# Altium schematic sheet Half_Bridge.SchDoc
size A4; SheetNumber: 6; SheetTotal: 9
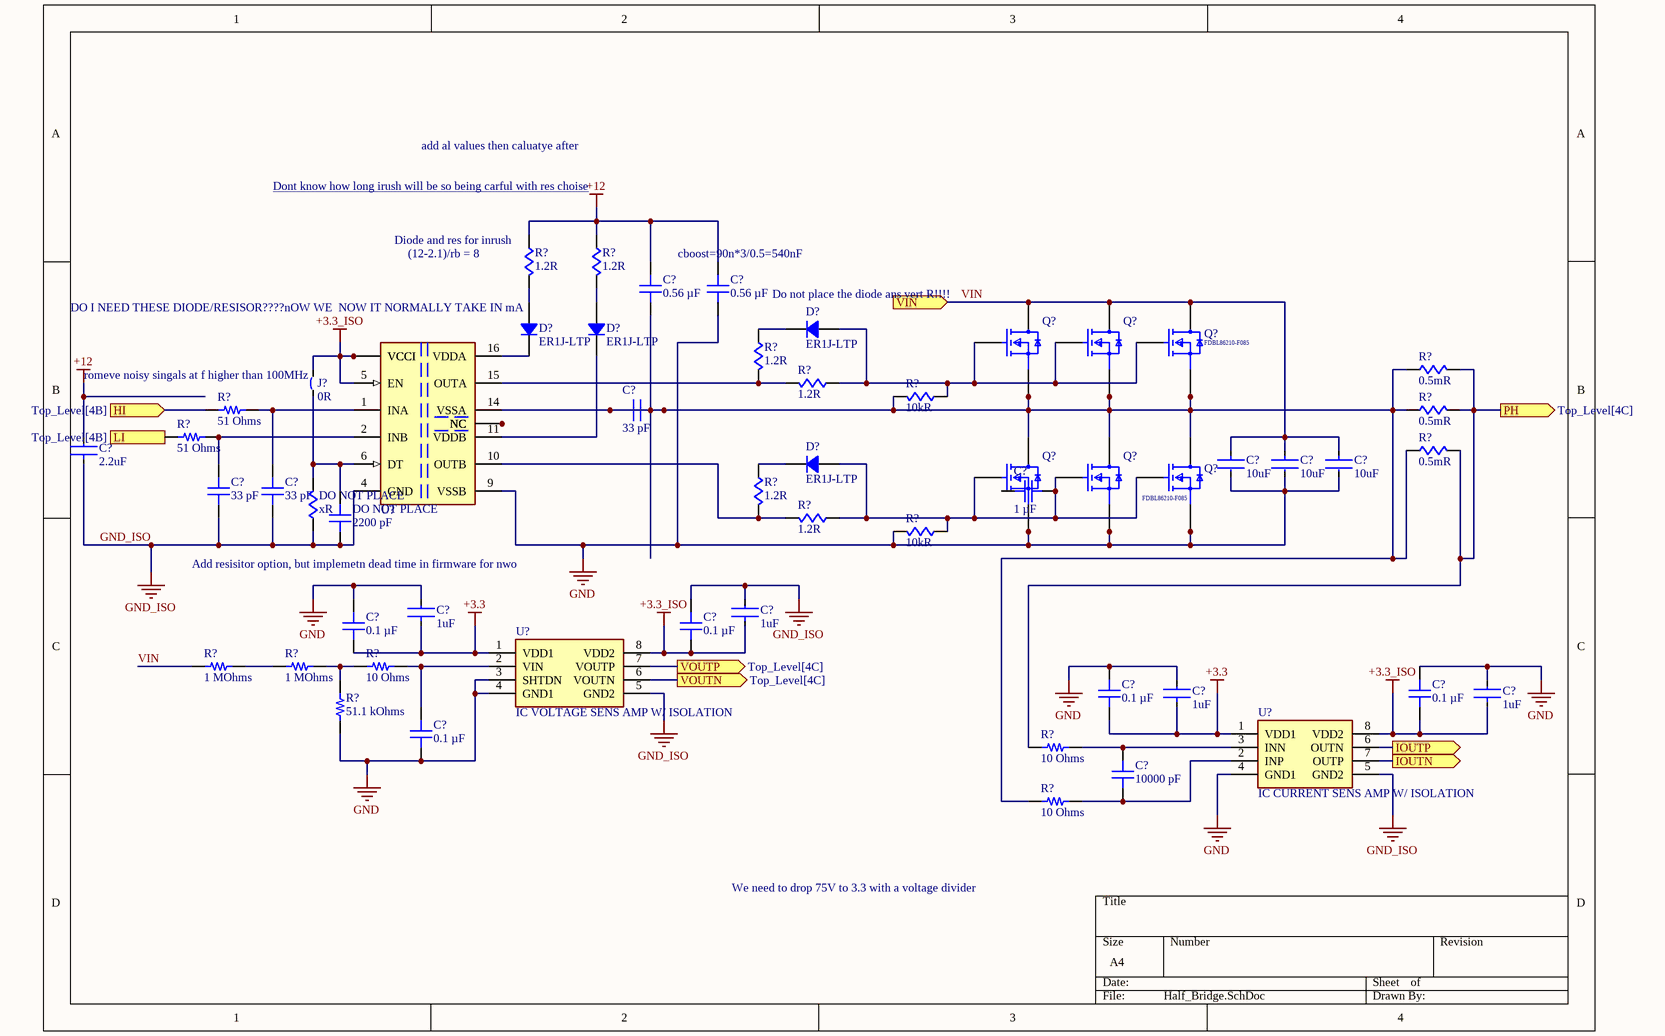
[diagram p0: Half_Bridge.SchDoc]

## Parts
(Parts that share a designator on the sheet are numbered #1, #2 ... from top to bottom, then left to right.)
C?#1  0.56 µF  [CAP 0805_2012]
C?#2  0.56 µF  [CAP 0805_2012]
C?#3  33 pF  [CAP 0402_1005]
C?#4  value 2.2uF  [FP-GCJ32D-0_4-IPC_C]  (hidden comment: SCER 2.2UF 100V X7R 1210)
C?#5  value 10uF  [FP-CL31-IPC_C]  (hidden comment: SCER 10UF 25V X7R 1206)
C?#6  value 10uF  [FP-CL31-IPC_C]  (hidden comment: SCER 10UF 25V X7R 1206)
C?#7  value 10uF  [FP-CL31-IPC_C]  (hidden comment: SCER 10UF 25V X7R 1206)
C?#8  33 pF  [CAP 0402_1005]
C?#9  33 pF  [CAP 0402_1005]
C?#10  1 µF  [CAP 0402_1005]
C?#11  value 1uF  [FP-CGA3E-0_3-0_1-IPC_C]  (hidden comment: CER 1UF 16V X7R 0603)
C?#12  value 1uF  [FP-CGA3E-0_3-0_1-IPC_C]  (hidden comment: CER 1UF 16V X7R 0603)
C?#13  0.1 µF  [CAP 0402_1005]
C?#14  0.1 µF  [CAP 0402_1005]
C?#15  0.1 µF  [CAP 0402_1005]
C?#16  value 1uF  [FP-CGA3E-0_3-0_1-IPC_C]  (hidden comment: CER 1UF 16V X7R 0603)
C?#17  0.1 µF  [CAP 0402_1005]
C?#18  value 1uF  [FP-CGA3E-0_3-0_1-IPC_C]  (hidden comment: CER 1UF 16V X7R 0603)
C?#19  0.1 µF  [CAP 0402_1005]
C?#20  10000 pF  [CAP 0603_1608]
D?#1  ER1J-LTP  [DO214AA SMB]
D?#2  ER1J-LTP  [DO214AA SMB]
D?#3  ER1J-LTP  [DO214AA SMB]
D?#4  ER1J-LTP  [DO214AA SMB]
DO_NOT_PLACE#1  value xR  [FP-RMCF0603-IPC_C]  (hidden comment: x)
DO_NOT_PLACE#2  2200 pF  [CAP 0402_1005]
J?  value 0R  [FP-RK73Z1J-IPC_C]  (hidden comment: RES 0 OHM JUMPER 0603)
Q?#1  N-CH 150V 169A 8HPSOF  [FP-100CU-MFG]  (value not drawn)
Q?#2  N-CH 150V 169A 8HPSOF  [FP-100CU-MFG]  (value not drawn)
Q?#3  N-CH 150V 169A 8HPSOF  [FP-100CU-MFG]  (value not drawn)
Q?#4  N-CH 150V 169A 8HPSOF  [FP-100CU-MFG]  (value not drawn)
Q?#5  N-CH 150V 169A 8HPSOF  [FP-100CU-MFG]  (value not drawn)
Q?#6  N-CH 150V 169A 8HPSOF  [FP-100CU-MFG]  (value not drawn)
R?#1  value 1.2R  [MMB0207_VIS-M]  (hidden comment: RES SMD 1.2 OHM 1% 1W 0207)
R?#2  value 1.2R  [MMB0207_VIS-M]  (hidden comment: RES SMD 1.2 OHM 1% 1W 0207)
R?#3  value 1.2R  [MMB0207_VIS-M]  (hidden comment: RES SMD 1.2 OHM 1% 1W 0207)
R?#4  value 0.5mR  [FP-PSL2NTEBL500F-MFG]  (hidden comment: RES 500 UOHM 1% 8W NONSTANDARD)
R?#5  value 1.2R  [MMB0207_VIS-M]  (hidden comment: RES SMD 1.2 OHM 1% 1W 0207)
R?#6  value 10kR  [FP-RMCF0603-IPC_C]  (hidden comment: RES 10K OHM 1% 1/10W 0603)
R?#7  51 Ohms  [RES 0402_1005]
R?#8  value 0.5mR  [FP-PSL2NTEBL500F-MFG]  (hidden comment: RES 500 UOHM 1% 8W NONSTANDARD)
R?#9  51 Ohms  [RES 0402_1005]
R?#10  value 0.5mR  [FP-PSL2NTEBL500F-MFG]  (hidden comment: RES 500 UOHM 1% 8W NONSTANDARD)
R?#11  value 1.2R  [MMB0207_VIS-M]  (hidden comment: RES SMD 1.2 OHM 1% 1W 0207)
R?#12  value 1.2R  [MMB0207_VIS-M]  (hidden comment: RES SMD 1.2 OHM 1% 1W 0207)
R?#13  value 10kR  [FP-RMCF0603-IPC_C]  (hidden comment: RES 10K OHM 1% 1/10W 0603)
R?#14  1 MOhms  [RES 0402_1005]
R?#15  1 MOhms  [RES 0402_1005]
R?#16  10 Ohms  [RES 0402_1005]
R?#17  51.1 kOhms  [RES 0402_1005]
R?#18  10 Ohms  [RES 0402_1005]
R?#19  10 Ohms  [RES 0402_1005]
U?#1  DGTL ISO 5.7KV GATE DRVR 16SOIC  [FP-DW0016B-IPC_B]  (value not drawn)
U?#2  IC VOLTAGE SENS AMP W/ ISOLATION  [SOIC127P1150X280-8N]
U?#3  IC CURRENT SENS AMP W/ ISOLATION  [FP-DWV0008A-IPC_B]

## Ports
HI (in, see Top_Level[4B]), IOUTN (out), IOUTP (out), LI (in, see Top_Level[4B]), PH (out, see Top_Level[4C]), VIN (in, see Top_Level[4B], Power[2A]), VOUTN (out, see Top_Level[4C]), VOUTP (out, see Top_Level[4C])

## Nets
+3.3: C?#11.1 C?#13.1 C?#15.1 C?#16.1 U?#2.1(VDD1) U?#3.1(VDD1)
+3.3_ISO: C?#12.1 C?#14.1 C?#17.1 C?#18.1 J?.2 U?#1.3(VCCI) U?#1.5(EN) U?#1.8(VCCI) U?#2.8(VDD2) U?#3.8(VDD2)
+12: C?#1.2 C?#2.2 C?#4.2 R?#1.1 R?#2.1
GND: C?#2.1 C?#5.2 C?#6.2 C?#7.2 C?#11.2 C?#13.2 C?#15.2 C?#16.2 C?#17.2 C?#18.2 C?#19.1 Q?#4.2(S) Q?#4.3(S) Q?#4.4(S) Q?#4.5(S) Q?#4.6(S) Q?#4.7(S) Q?#4.8(S) Q?#5.2(S) Q?#5.3(S) Q?#5.4(S) Q?#5.5(S) Q?#5.6(S) Q?#5.7(S) Q?#5.8(S) Q?#6.2(S) Q?#6.3(S) Q?#6.4(S) Q?#6.5(S) Q?#6.6(S) Q?#6.7(S) Q?#6.8(S) R?#13.2 R?#17.1 U?#1.9(VSSB) U?#2.3(SHTDN) U?#2.4(GND1) U?#3.4(GND1)
GND_ISO: C?#4.1 C?#8.1 C?#9.1 C?#12.2 C?#14.2 DO_NOT_PLACE#1.1 DO_NOT_PLACE#2.1 U?#1.4(GND) U?#2.5(GND2) U?#3.5(GND2)
HI: R?#7.1 ; port HI
IOUTN: U?#3.7(OUTP) ; port IOUTN
IOUTP: U?#3.6(OUTN) ; port IOUTP
LI: R?#9.1 ; port LI
PH: R?#4.2 R?#8.2 R?#10.2 R?#18.1 ; port PH
VIN: C?#5.1 C?#6.1 C?#7.1 Q?#1.9(D) Q?#2.9(D) Q?#3.9(D) R?#14.1 ; port VIN
VOUTN: U?#2.6(VOUTN) ; port VOUTN
VOUTP: U?#2.7(VOUTP) ; port VOUTP
NetC?#1_1: C?#1.1 C?#3.1 C?#3.2 Q?#1.2(S) Q?#1.3(S) Q?#1.4(S) Q?#1.5(S) Q?#1.6(S) Q?#1.7(S) Q?#1.8(S) Q?#2.2(S) Q?#2.3(S) Q?#2.4(S) Q?#2.5(S) Q?#2.6(S) Q?#2.7(S) Q?#2.8(S) Q?#3.2(S) Q?#3.3(S) Q?#3.4(S) Q?#3.5(S) Q?#3.6(S) Q?#3.7(S) Q?#3.8(S) Q?#4.9(D) Q?#5.9(D) Q?#6.9(D) R?#4.1 R?#6.2 R?#8.1 R?#10.1 R?#19.1 U?#1.14(VSSA)
NetC?#8_2: C?#8.2 R?#9.2 U?#1.2(INB)
NetC?#9_2: C?#9.2 R?#7.2 U?#1.1(INA)
NetC?#10_2: C?#10.2 D?#4.1 Q?#4.1(G) Q?#5.1(G) Q?#6.1(G) R?#12.1 R?#13.1
NetC?#19_2: C?#19.2 R?#16.2 U?#2.2(VIN)
NetC?#20_1: C?#20.1 R?#19.2 U?#3.2(INP)
NetC?#20_2: C?#20.2 R?#18.2 U?#3.3(INN)
NetD?#1_1: D?#1.1 R?#1.2
NetD?#1_2: D?#1.2 U?#1.16(VDDA)
NetD?#2_1: D?#2.1 R?#2.2
NetD?#2_2: D?#2.2 U?#1.11(VDDB)
NetD?#3_1: D?#3.1 Q?#1.1(G) Q?#2.1(G) Q?#3.1(G) R?#5.1 R?#6.1
NetD?#3_2: D?#3.2 R?#3.1
NetD?#4_2: D?#4.2 R?#11.1
NetDO_NOT_PLACE#1_2: DO_NOT_PLACE#1.2 DO_NOT_PLACE#2.2 J?.1 U?#1.6(DT)
NetR?#3_2: R?#3.2 R?#5.2 U?#1.15(OUTA)
NetR?#11_2: R?#11.2 R?#12.2 U?#1.10(OUTB)
NetR?#14_2: R?#14.2 R?#15.1
NetR?#15_2: R?#15.2 R?#16.1 R?#17.2
NetU?#1_7: U?#1.7(NC) U?#1.12(NC) U?#1.13(NC)

Not connected (* = marked no-connect by the designer): C?#10 1

## Notes on the sheet
- add al values then caluatye after
- Dont know how long irush will be so being carful with res choise <https://www.vishay.com/docs/48516/_ms9702509-2003-vishaychecklistpulseload.pdf>
- (near R?#1) Diode and res for inrush
- DO I NEED THESE DIODE/RESISOR????nOW WE  NOW IT NORMALLY TAKE IN mA
- (near R?#1) (12-2.1)/rb = 8
- (near C?#2) cboost=90n*3/0.5=540nF
- Do not place the diode ans vert R!!!!
- (near J?) romeve noisy singals at f higher than 100MHz
- Add resisitor option, but implemetn dead time in firmware for nwo
- We need to drop 75V to 3.3 with a voltage divider

## Library data of the parts
C?#1 C?#2 = C0805C564K5RAC7800: CAP CER 0.56UF 50V X7R 0805; manufacturer: KEMET; Tolerance: ±10%; Part Number: C0805C564K5RAC7800; Value: 0.56 µF; Applications: Bypass, Decoupling; Capacitance: 0.56 µF; componentlink1description: Datasheet; componentlink1url: https://api.kemet.com/component-edge/download/datasheet/C0805C564K5RACTU.pdf; componentlink2description: DigiKey Link; componentlink2url: https://www.digikey.com/en/products/detail/kemet/C0805C564K5RAC7800/2213027; Device Package: 0805 (2012 Metric); lastupdated: 2023-06-12 7:19:40 PM; Lifecycle Status: Active; Minimum Order: 1; Mounting Type: Surface Mount, MLCC; Operating Temperature: -55°C ~ 125°C; Package / Case: 0805 (2012 Metric); packaging: TapeAndReel; partid: 32914; Part Status: Active; price: 0.14; series: SMD Comm X7R; Size / Dimension: 0.079" L x 0.049" W (2.00mm x 1.25mm); Supplier 1: DigiKey; Supplier Part Number 1: 399-C0805C564K5RAC7800CT-ND; Temperature Coefficient: X7R; Thickness (Max): 0.057" (1.45mm); Voltage - Rated: 50V
C?#3 = CBR04C330F2GAC: CAP CER 33PF 200V C0G/NP0 0402; manufacturer: KEMET; Temperature Coefficient: C0G, NP0; Tolerance: ±1%; Part Number: CBR04C330F2GAC; Value: 33 pF; Applications: RF, Microwave, High Frequency; Capacitance: 33 pF; componentlink1description: Datasheet; componentlink1url: https://api.kemet.com/component-edge/download/datasheet/CBR04C330F2GAC.pdf; componentlink2description: DigiKey Link; componentlink2url: https://www.digikey.com/en/products/detail/kemet/CBR04C330F2GAC/7649643; Device Package: 0402 (1005 Metric); Features: High Q, Low Loss, Ultra Low ESR; lastupdated: 2023-06-12 7:06:40 PM; Lifecycle Status: Active; Minimum Order: 1; Mounting Type: Surface Mount, MLCC; Operating Temperature: -55°C ~ 125°C; Package / Case: 0402 (1005 Metric); packaging: TapeAndReel; partid: 6625; Part Status: Active; price: 0.24; series: CBR-SMD RF C0G; Size / Dimension: 0.039" L x 0.020" W (1.00mm x 0.50mm); Supplier 1: DigiKey; Supplier Part Number 1: 399-16337-1-ND; Thickness (Max): 0.022" (0.55mm); Voltage - Rated: 200V
C?#4 = GCJ32DR72A225KA01L: CER 2.2UF 100V X7R 1210; Manufacturer: Murata; Dielectric Material: Ceramic; Multilayer: Yes; Tolerance  (fill in as +-): 10%; Reference Standard: AEC-Q200; Supplier: Digi-Key; Supplier Part Number: 490-5840-1-ND; Manufacturer Part Number: GCJ32DR72A225KA01L; RoHS: Yes; Category: Ceramic Capacitors; Stock: 318636; Pricing: 1=1.74, 10=1.375, 50=1.1914, 100=1.031, 500=0.779 (USD); Mounting Technology: Surface Mount; Pins: 2; Package Shape: Rectangular; Case/Package: 1210; Terminal Finish: Nickel; Min Operating Temperature: -55°C; Max Operating Temperature: 125°C; JESD-609 Code: e3; Capacitor Type: Ceramic; Package Style: SMTMeter; Packaging: Tape and Reel; Tolerance (fill in as +-): 10%; Rated DC Voltage (URdc): 100V; Temperature Characteristics Code: X7R; Termination: Wraparound; Length: 3.2mm; Width: 2.5mm; Height: 2mm; Reach SVHC Compliant: Yes; RoHS Compliant: Yes; ComponentLink1URL: https://psearch.en.murata.com:443/capacitor/product/GCJ32DR72A225KA01%23.pdf?src-supplier=IHS+Markit; ComponentLink1Description: https://psearch.en.murata.com:443/capacitor/product/GCJ32DR72A225KA01%23.pdf?src-supplier=IHS+Markit; ComponentLink2URL: https://datasheet.ciiva.com/175/s0717e-175728.pdf?src-supplier=Digi-Key; ComponentLink2Description: https://datasheet.ciiva.com/175/s0717e-175728.pdf?src-supplier=Digi-Key; ComponentLink3URL: https://datasheet.ciiva.com/175/s0717e-175727.pdf?src-supplier=Digi-Key; ComponentLink3Description: https://datasheet.ciiva.com/175/s0717e-175727.pdf?src-supplier=Digi-Key; ComponentLink4URL: https://datasheet.ciiva.com/175/s0717e-175729.pdf?src-supplier=Digi-Key; ComponentLink4Description: https://datasheet.ciiva.com/175/s0717e-175729.pdf?src-supplier=Digi-Key
C?#5-C?#7 = CL31B106KAHVPNE: CER 10UF 25V X7R 1206; Manufacturer: Samsung; Dielectric Material: Ceramic; Multilayer: Yes; Tolerance  (fill in as +-): 10%; Reference Standard: AEC-Q200; Supplier: Digi-Key; Supplier Part Number: 1276-6814-1-ND; Manufacturer Part Number: CL31B106KAHVPNE; RoHS: Yes; Category: Ceramic Capacitors; Stock: 960621; Pricing: 1=0.44, 10=0.314, 50=0.2376, 100=0.2069, 500=0.15324, 1000=0.13025 (USD); Mounting Technology: Surface Mount; Pins: 2; Package Shape: Rectangular; Case/Package: 1206; Terminal Finish: Nickel; Min Operating Temperature: -55°C; Max Operating Temperature: 125°C; JESD-609 Code: e3; Capacitor Type: Ceramic; Packaging: Tape and Reel; Tolerance (fill in as +-): 10%; Rated DC Voltage (URdc): 25V; Temperature Characteristics Code: X7R; Termination: Wraparound; Reach SVHC Compliant: Yes; RoHS Compliant: Yes; ComponentLink1URL: https://datasheet.ciiva.com:443/pdfs/VipMasterIC/IC/SEMS/SEMS-S-A0009022704/SEMS-S-A0009023146-1.pdf?src-supplier=IHS+Markit; ComponentLink1Description: https://datasheet.ciiva.com:443/pdfs/VipMasterIC/IC/SEMS/SEMS-S-A0009022704/SEMS-S-A0009023146-1.pdf?src-supplier=IHS+Markit; ComponentLink2URL: http://www.samsungsem.com/kr/support/product-search/mlcc/CL31B106KAHVPNE.jsp?src-supplier=Digi-Key; ComponentLink2Description: http://www.samsungsem.com/kr/support/product-search/mlcc/CL31B106KAHVPNE.jsp?src-supplier=Digi-Key; ComponentLink3URL: http://www.samsungsem.com/kr/support/library/product-catalog/mlcc.jsp?src-supplier=Digi-Key; ComponentLink3Description: http://www.samsungsem.com/kr/support/library/product-catalog/mlcc.jsp?src-supplier=Digi-Key
C?#8 C?#9 = 885012005077: CAP CER 33PF 100V C0G/NP0 0402; manufacturer: Würth Elektronik; Temperature Coefficient: C0G, NP0; Tolerance: ±5%; Part Number: 885012005077; Value: 33 pF; Applications: General Purpose; Capacitance: 33 pF; componentlink1description: Datasheet; componentlink1url: https://katalog.we-online.de/pbs/datasheet/885012005077.pdf; componentlink2description: DigiKey Link; componentlink2url: https://www.digikey.com/en/products/detail/würth-elektronik/885012005077/9345882; Device Package: 0402 (1005 Metric); lastupdated: 2023-06-12 7:06:58 PM; Lifecycle Status: Active; Minimum Order: 1; Mounting Type: Surface Mount, MLCC; Operating Temperature: -55°C ~ 125°C; Package / Case: 0402 (1005 Metric); packaging: TapeAndReel; partid: 1795; Part Status: Active; price: 0.03; series: WCAP-CSGP; Size / Dimension: 0.039" L x 0.020" W (1.00mm x 0.50mm); Supplier 1: DigiKey; Supplier Part Number 1: 732-12070-1-ND; Thickness (Max): 0.022" (0.55mm); Voltage - Rated: 100V
C?#10 = UMK105CBJ105MV-F: CAP CER 1UF 50V X5R 0402; manufacturer: Taiyo Yuden; Tolerance: ±20%; Part Number: UMK105CBJ105MV-F; Value: 1 µF; Applications: SMPS Filtering; Capacitance: 1 µF; componentlink1description: Datasheet; componentlink1url: https://ds.yuden.co.jp/TYCOMPAS/ut/detail?pn=UMK105CBJ105MV-F &u=M; componentlink2description: DigiKey Link; componentlink2url: https://www.digikey.com/en/products/detail/taiyo-yuden/UMK105CBJ105MV-F/7403871; Device Package: 0402 (1005 Metric); lastupdated: 2023-06-19 7:05:29 PM; Lifecycle Status: Active; Minimum Order: 1; Mounting Type: Surface Mount, MLCC; Operating Temperature: -55°C ~ 85°C; Package / Case: 0402 (1005 Metric); packaging: TapeAndReel; partid: 11825; Part Status: Active; price: 0.03; series: M; Size / Dimension: 0.039" L x 0.020" W (1.00mm x 0.50mm); Supplier 1: DigiKey; Supplier Part Number 1: 587-6278-1-ND; Temperature Coefficient: X5R; Thickness (Max): 0.028" (0.70mm); Voltage - Rated: 50V
C?#11 C?#12 C?#16 C?#18 = CGA3E1X7R1C105K080AC: Manufacturer: TDK; Dielectric Material: Ceramic; Multilayer: Yes; Tolerance  (fill in as +-): 10%; Reference Standard: AEC-Q200; Supplier: Digi-Key; Supplier Part Number: 445-12539-1-ND; Manufacturer Part Number: CGA3E1X7R1C105K080AC; RoHS: Yes; Category: Ceramic Capacitors; Stock: 2379528; Pricing: 1=0.12, 10=0.088, 50=0.0498, 100=0.0413, 500=0.02896, 1000=0.02397 (USD); Mounting Technology: Surface Mount; Pins: 2; Package Shape: Rectangular; Case/Package: 0603; Terminal Finish: Nickel; Min Operating Temperature: -55°C; Max Operating Temperature: 125°C; JESD-609 Code: e3; Capacitor Type: Ceramic; Package Style: SMTMeter; Packaging: Tape and Reel; Tolerance (fill in as +-): 10%; Rated DC Voltage (URdc): 16V; Temperature Characteristics Code: X7R; Termination: Wraparound; Length: 1.6mm; Width: 0.8mm; Height: 0.8mm; Reach SVHC Compliant: Yes; RoHS Compliant: Yes; ComponentLink1URL: https://datasheet.ciiva.com:443/pdfs/VipMasterIC/IC/TDKC/TDKC-S-A0008953915/TDKC-S-A0008953915-1.pdf?src-supplier=IHS+Markit; ComponentLink1Description: https://datasheet.ciiva.com:443/pdfs/VipMasterIC/IC/TDKC/TDKC-S-A0008953915/TDKC-S-A0008953915-1.pdf?src-supplier=IHS+Markit; ComponentLink2URL: http://www.farnell.com/datasheets/2292075.pdf?src-supplier=Farnell; ComponentLink2Description: http://www.farnell.com/datasheets/2292075.pdf?src-supplier=Farnell; ComponentLink3URL: https://product.tdk.com/info/en/documents/chara_sheet/CGA3E1X7R1C105K080AC.pdf?src-supplier=Digi-Key; ComponentLink3Description: https://product.tdk.com/info/en/documents/chara_sheet/CGA3E1X7R1C105K080AC.pdf?src-supplier=Digi-Key; ComponentLink4URL: https://product.tdk.com/info/en/catalog/datasheets/mlcc_automotive_general_en.pdf?src-supplier=Digi-Key; ComponentLink4Description: https://product.tdk.com/info/en/catalog/datasheets/mlcc_automotive_general_en.pdf?src-supplier=Digi-Key; ComponentLink5URL: http://product.tdk.com/capacitor/mlcc/en/documents/mlcc_automotive_general_en.pdf?src-supplier=Avnet; ComponentLink5Description: http://product.tdk.com/capacitor/mlcc/en/documents/mlcc_automotive_general_en.pdf?src-supplier=Avnet; ComponentLink6URL: http://www.farnell.com/datasheets/2292075.pdf?src-supplier=Element14; ComponentLink6Description: http://www.farnell.com/datasheets/2292075.pdf?src-supplier=Element14; ComponentLink7URL: http://www.farnell.com/datasheets/2292075.pdf?src-supplier=Newark; ComponentLink7Description: http://www.farnell.com/datasheets/2292075.pdf?src-supplier=Newark; ComponentLink8URL: http://product.tdk.com/capacitor/mlcc/detailed_information.php?lang=en&ref=jp&part_no=CGA3E1X7R1C105K080AC&src-supplier=Mouser; ComponentLink8Description: http://product.tdk.com/capacitor/mlcc/detailed_information.php?lang=en&ref=jp&part_no=CGA3E1X7R1C105K080AC&src-supplier=Mouser
C?#13-C?#15 C?#17 C?#19 = UMK105B7104KVHF: CAP CER 0.1UF 50V X7R 0402; manufacturer: Taiyo Yuden; Tolerance: ±10%; Part Number: UMK105B7104KVHF; Value: 0.1 µF; Applications: Automotive; Capacitance: 0.1 µF; componentlink1description: Datasheet; componentlink1url: https://ds.yuden.co.jp/TYCOMPAS/ut/detail?pn=UMK105B7104KVHF  &u=M; componentlink2description: DigiKey Link; componentlink2url: https://www.digikey.com/en/products/detail/taiyo-yuden/UMK105B7104KVHF/5400876; Device Package: 0402 (1005 Metric); lastupdated: 2023-06-19 7:05:52 PM; Lifecycle Status: Active; Minimum Order: 1; Mounting Type: Surface Mount, MLCC; Operating Temperature: -55°C ~ 125°C; Package / Case: 0402 (1005 Metric); packaging: TapeAndReel; partid: 3241; Part Status: Active; price: 0.02; Ratings: AEC-Q200; series: M; Size / Dimension: 0.039" L x 0.020" W (1.00mm x 0.50mm); Supplier 1: DigiKey; Supplier Part Number 1: 587-4330-1-ND; Temperature Coefficient: X7R; Thickness (Max): 0.022" (0.55mm); Voltage - Rated: 50V
C?#20 = CGA3EAC0G2A103J080AC: CAP CER 10000PF 100V C0G 0603; manufacturer: TDK Corporation; Temperature Coefficient: C0G, NP0; Tolerance: ±5%; Part Number: CGA3EAC0G2A103J080AC; Value: 10000 pF; Applications: Automotive, ESD Protection; Capacitance: 10000 pF; componentlink1description: Datasheet; componentlink1url: https://product.tdk.com/info/en/catalog/datasheets/mlcc_automotive_esd_en.pdf?ref_disty=digikey; componentlink2description: DigiKey Link; componentlink2url: https://www.digikey.com/en/products/detail/tdk-corporation/CGA3EAC0G2A103J080AC/4712774; Device Package: 0603 (1608 Metric); lastupdated: 2023-06-26 7:13:22 PM; Lifecycle Status: Active; Minimum Order: 1; Mounting Type: Surface Mount, MLCC; Operating Temperature: -55°C ~ 125°C; Package / Case: 0603 (1608 Metric); packaging: TapeAndReel; partid: 4154; Part Status: Active; price: 0.06; Ratings: AEC-Q200; series: CGA; Size / Dimension: 0.063" L x 0.031" W (1.60mm x 0.80mm); Supplier 1: DigiKey; Supplier Part Number 1: 445-16158-1-ND; Thickness (Max): 0.035" (0.90mm); Voltage - Rated: 100V
D?#1-D?#4 = ER1J-LTP: DIODE GEN PURP 600V 1A DO214AA; Manufacturer: Micro Commercial Co; Capacitance @ Vr, F: 15pF @ 4V, 1MHz; Current - Reverse Leakage @ Vr: 5 µA @ 600 V; Diode Type: Standard; Reverse Recovery Time (trr): 35 ns; Speed: Fast Recovery =< 500ns, > 200mA (Io); Voltage - Forward (Vf) (Max) @ If: 1.7 V @ 1 A; Part Number: ER1J-LTP; ComponentLink1Description: Datasheet; ComponentLink1URL: https://www.mccsemi.com/pdf/Products/ER1A-L~ER1J-L(DO-214AA).pdf; ComponentLink2Description: DigiKey Link; ComponentLink2URL: https://www.digikey.com/en/products/detail/micro-commercial-co/ER1J-LTP/2512789; Current - Average Rectified (Io): 1A; LastUpdated: 2023-06-11 8:21:08 PM; Lifecycle Status: Active; Minimum Order: 1; Mounting Type: Surface Mount; Operating Temperature - Junction: -65°C ~ 175°C; Package / Case: DO-214AA, SMB; Packaging: TapeAndReel; PartId: 22; Part Status: Active; Price: 0.04; Series: -; Supplier 1: DigiKey; Supplier Part Number 1: ER1J-LTPMSCT-ND; Supplier Device Package: DO-214AA (SMB); Voltage - DC Reverse (Vr) (Max): 600 V
DO_NOT_PLACE#1 = RES 0603
DO_NOT_PLACE#2 = C0402C222J3GACAUTO: CAP CER 2200PF 25V C0G/NP0 0402; manufacturer: KEMET; Temperature Coefficient: C0G, NP0; Tolerance: ±5%; Part Number: C0402C222J3GACAUTO; Value: 2200 pF; Applications: Automotive; Capacitance: 2200 pF; componentlink1description: Datasheet; componentlink1url: https://api.kemet.com/component-edge/download/datasheet/C0402C222J3GACAUTO.pdf; componentlink2description: DigiKey Link; componentlink2url: https://www.digikey.com/en/products/detail/kemet/C0402C222J3GACAUTO/10642343; Device Package: 0402 (1005 Metric); Features: Low ESL; lastupdated: 2023-06-12 7:06:10 PM; Lifecycle Status: Active; Minimum Order: 1; Mounting Type: Surface Mount, MLCC; Operating Temperature: -55°C ~ 125°C; Package / Case: 0402 (1005 Metric); packaging: TapeAndReel; partid: 33507; Part Status: Active; price: 0.08; Ratings: AEC-Q200; series: SMD Auto C0G; Size / Dimension: 0.039" L x 0.020" W (1.00mm x 0.50mm); Supplier 1: DigiKey; Supplier Part Number 1: 399-C0402C222J3GACAUTOCT-ND; Thickness (Max): 0.022" (0.55mm); Voltage - Rated: 25V
J? = RK73Z1JTTD: Manufacturer: KOA Speer; Rated Temperature: 70°C; Package Height: 0.45mm; Package Length: 1.6mm; Package Width: 0.8mm; Reference Standard: AEC-Q200; Supplier: Digi-Key; Supplier Part Number: 2019-RK73Z1JTTDCT-ND; Manufacturer Part Number: RK73Z1JTTD; RoHS: Yes; Category: Chip SMD Resistors; Stock: 8562065; Pricing: 1=0.1, 10=0.016, 50=0.0088, 100=0.0065, 500=0.00396, 1000=0.00292 (USD); Mounting Technology: Surface Mount; Pins: 2; Case/Package: 0603; Terminal Finish: Nickel; Min Operating Temperature: -55°C; Max Operating Temperature: 155°C; JESD-609 Code: e3; Resistor Type: FIXED RESISTOR; Construction: Rectangular; Package Style: SMTMeter; Packaging: Tape and Reel; Termination: Wraparound; Reach SVHC Compliant: Yes; RoHS Compliant: Yes; ComponentLink1URL: https://datasheet.ciiva.com:443/pdfs/VipMasterIC/IC/KOAS/KOAS-S-A0009586251/KOAS-S-A0009586308-1.pdf?src-supplier=IHS+Markit; ComponentLink1Description: https://datasheet.ciiva.com:443/pdfs/VipMasterIC/IC/KOAS/KOAS-S-A0009586251/KOAS-S-A0009586308-1.pdf?src-supplier=IHS+Markit; ComponentLink2URL: https://datasheet.ciiva.com/7816/549012-7816884.pdf?src-supplier=Element14; ComponentLink2Description: https://datasheet.ciiva.com/7816/549012-7816884.pdf?src-supplier=Element14; ComponentLink3URL: https://datasheet.ciiva.com/26914/getdatasheetpartid-123499-26914653.pdf?src-supplier=Verical; ComponentLink3Description: https://datasheet.ciiva.com/26914/getdatasheetpartid-123499-26914653.pdf?src-supplier=Verical
Q?#1-Q?#6 = FDBL86210-F085: Manufacturer: ON Semiconductor; Polarity/Channel Type: N-CHANNEL; FET Technology: METAL-OXIDE SEMICONDUCTOR; Power Dissipation-Max (Abs): 500W; Supplier: Digi-Key; Supplier Part Number: FDBL86210-F085CT-ND; Manufacturer Part Number: FDBL86210-F085; RoHS: Yes; Category: MOSFETs; Stock: 9997; Pricing: 1=6.08, 10=5.463, 100=4.4761, 500=3.81042, 1000=3.2136 (USD); Terminal Finish: Tin; Max Operating Temperature: 175°C; Drain Current-Max (Abs) (ID): 169A; Moisture Sensitivity Level: 1; Surface Mount: Yes; JESD-609 Code: e3; RoHS Compliant: Yes; Reach SVHC Compliant: No; ComponentLink1URL: https://datasheet.ciiva.com:443/pdfs/VipMasterIC/IC/ONSM/ONSM-S-A0003157691/ONSM-S-A0003586469-1.pdf?src-supplier=IHS+Markit; ComponentLink1Description: https://datasheet.ciiva.com:443/pdfs/VipMasterIC/IC/ONSM/ONSM-S-A0003157691/ONSM-S-A0003586469-1.pdf?src-supplier=IHS+Markit; ComponentLink2URL: http://www.farnell.com/datasheets/2859346.pdf?src-supplier=Farnell; ComponentLink2Description: http://www.farnell.com/datasheets/2859346.pdf?src-supplier=Farnell; ComponentLink3URL: http://www.onsemi.com/pub/Collateral/FDBL86210_F085-D.PDF?src-supplier=Digi-Key; ComponentLink3Description: http://www.onsemi.com/pub/Collateral/FDBL86210_F085-D.PDF?src-supplier=Digi-Key; ComponentLink4URL: http://www.farnell.com/datasheets/2859346.pdf?src-supplier=Element14; ComponentLink4Description: http://www.farnell.com/datasheets/2859346.pdf?src-supplier=Element14; ComponentLink5URL: http://www.farnell.com/datasheets/2859346.pdf?src-supplier=Newark; ComponentLink5Description: http://www.farnell.com/datasheets/2859346.pdf?src-supplier=Newark
R?#1-R?#3 R?#5 R?#11 R?#12 = MMB02070C1208FB200: Manufacturer: Vishay; Power: 400mW; Rated Temperature: 70°C; Temperature Coefficient: 50ppm/°C; Working Voltage: 300V; Package Diameter: 2.2mm; Package Length: 5.8mm; Reference Standard: AEC-Q200; Supplier: Digi-Key; Supplier Part Number: 749-MMB02070C1208FB200CT-ND; Manufacturer Part Number: MMB02070C1208FB200; RoHS: Yes; Category: Chip SMD Resistors; Stock: 3580; Pricing: 1=0.57, 10=0.41, 100=0.2129, 500=0.14742, 1000=0.11466 (USD); Mounting Technology: Surface Mount; Pins: 2; Package Shape: Cylindrical; Case/Package: 2309; Terminal Finish: Nickel; Min Operating Temperature: -55°C; Max Operating Temperature: 125°C; Tolerance: 1%; JESD-609 Code: e3; Resistor Type: FIXED RESISTOR; Construction: Cylindrical; Package Style: MELFMeter; Packaging: Tape and Reel; Technology: THIN FILM; Termination: Wraparound; Reach SVHC Compliant: Yes; RoHS Compliant: Yes; ComponentLink1URL: https://datasheet.ciiva.com:443/pdfs/VipMasterIC/IC/VISH/VISH-S-A0004853152/VISH-S-A0004853152-1.pdf?src-supplier=IHS+Markit; ComponentLink1Description: https://datasheet.ciiva.com:443/pdfs/VipMasterIC/IC/VISH/VISH-S-A0004853152/VISH-S-A0004853152-1.pdf?src-supplier=IHS+Markit; ComponentLink2URL: https://datasheet.ciiva.com/11811/0900766b80d81c43-11811863.pdf?src-supplier=Rs; ComponentLink2Description: https://datasheet.ciiva.com/11811/0900766b80d81c43-11811863.pdf?src-supplier=Rs; ComponentLink3URL: https://datasheet.ciiva.com/26316/nbmma0204-mmb0207-e-26316346.pdf?src-supplier=Distrelec; ComponentLink3Description: https://datasheet.ciiva.com/26316/nbmma0204-mmb0207-e-26316346.pdf?src-supplier=Distrelec; ComponentLink4URL: https://datasheet.ciiva.com/7861/1696496-7861166.pdf?src-supplier=Element14; ComponentLink4Description: https://datasheet.ciiva.com/7861/1696496-7861166.pdf?src-supplier=Element14; ComponentLink5URL: https://datasheet.ciiva.com/7861/1696496-7861167.pdf?src-supplier=Element14; ComponentLink5Description: https://datasheet.ciiva.com/7861/1696496-7861167.pdf?src-supplier=Element14
R?#4 R?#8 R?#10 = PSL2NTEBL500F: Manufacturer: KOA Speer; Rated Temperature: 75°C; Temperature Coefficient: 115ppm/°C; Package Height: 1.12mm; Package Length: 6.3mm; Package Width: 3.15mm; Reference Standard: AEC-Q200; Supplier: Digi-Key; Supplier Part Number: 2019-PSL2NTEBL500FCT-ND; Manufacturer Part Number: PSL2NTEBL500F; RoHS: Yes; Category: Chip SMD Resistors; Stock: 28086; Pricing: 1=1.59, 10=1.409, 25=1.2952, 50=1.1816, 100=1.0226, 250=0.86356, 500=0.7272, 1000=0.60448 (USD); Mounting Technology: Surface Mount; Pins: 2; Case/Package: 2512; Min Operating Temperature: -65°C; Max Operating Temperature: 175°C; Tolerance: 1%; Resistor Type: FIXED RESISTOR; Construction: Rectangular; Package Style: SMTMeter; Packaging: Tape and Reel; Power: 8W; Termination: Gull Wing; Reach SVHC Compliant: Yes; RoHS Compliant: Yes; ComponentLink1URL: https://datasheet.ciiva.com:443/pdfs/VipMasterIC/IC/KOAS/KOAS-S-A0009586241/KOAS-S-A0009586241-1.pdf?src-supplier=IHS+Markit; ComponentLink1Description: https://datasheet.ciiva.com:443/pdfs/VipMasterIC/IC/KOAS/KOAS-S-A0009586241/KOAS-S-A0009586241-1.pdf?src-supplier=IHS+Markit
R?#6 R?#13 = RMCF0603FT10K0: Manufacturer: Stackpole Electronics; Power: 100mW; Rated Temperature: 70°C; Temperature Coefficient: 100ppm/°C; Working Voltage: 75V; Package Height: 0.45mm; Package Length: 1.55mm; Package Width: 0.8mm; Reference Standard: AEC-Q200; Supplier: Digi-Key; Supplier Part Number: RMCF0603FT10K0CT-ND; Manufacturer Part Number: RMCF0603FT10K0; RoHS: Yes; Category: Chip SMD Resistors; Stock: 10390822; Pricing: 1=0.1, 10=0.015, 50=0.009, 100=0.0075, 500=0.00498, 1000=0.00425 (USD); Mounting Technology: Surface Mount; Pins: 2; Package Shape: Rectangular; Case/Package: 0603; Terminal Finish: Nickel; Min Operating Temperature: -55°C; Max Operating Temperature: 155°C; Tolerance: 1%; JESD-609 Code: e3; Resistor Type: FIXED RESISTOR; Construction: Rectangular; Package Style: SMTMeter; Packaging: Tape and Reel; Technology: METAL GLAZE/THICK FILM; Termination: Wraparound; Reach SVHC Compliant: Yes; RoHS Compliant: Yes; ComponentLink1URL: https://datasheet.ciiva.com:443/pdfs/VipMasterIC/IC/SEIE/SEIE-S-A0009541969/SEIE-S-A0009541969-1.pdf?src-supplier=IHS+Markit; ComponentLink1Description: https://datasheet.ciiva.com:443/pdfs/VipMasterIC/IC/SEIE/SEIE-S-A0009541969/SEIE-S-A0009541969-1.pdf?src-supplier=IHS+Markit; ComponentLink2URL: http://components.arrow.com/part/dataview/43747082S6756917N1174?src-supplier=Arrow+Electronics; ComponentLink2Description: http://components.arrow.com/part/dataview/43747082S6756917N1174?src-supplier=Arrow+Electronics; ComponentLink3URL: https://www.seielect.com/catalog/SEI-RMCF_RMCP.pdf?src-supplier=Avnet; ComponentLink3Description: https://www.seielect.com/catalog/SEI-RMCF_RMCP.pdf?src-supplier=Avnet; ComponentLink4URL: http://www.seielect.com/catalog/sei-rmc.pdf?src-supplier=Future+Electronics; ComponentLink4Description: http://www.seielect.com/catalog/sei-rmc.pdf?src-supplier=Future+Electronics; ComponentLink5URL: https://www.verical.com/server-webapp/html/getDatasheet?partID=360913&src-supplier=Verical; ComponentLink5Description: https://www.verical.com/server-webapp/html/getDatasheet?partID=360913&src-supplier=Verical; ComponentLink6URL: https://www.seielect.com/catalog/sei-rmcf_rmcp.pdf?src-supplier=Digi-Key; ComponentLink6Description: https://www.seielect.com/catalog/sei-rmcf_rmcp.pdf?src-supplier=Digi-Key
R?#7 R?#9 = RMCF0402FT51R0: RES 51 OHM 1% 1/16W 0402; Manufacturer: Stackpole Electronics Inc; Power (Watts): 0.063W, 1/16W; Temperature Coefficient: ±100ppm/°C; Part Number: RMCF0402FT51R0; Value: 51 Ohms; ComponentLink1Description: Datasheet; ComponentLink1URL: https://www.seielect.com/catalog/sei-rmcf_rmcp.pdf; ComponentLink2Description: DigiKey Link; ComponentLink2URL: https://www.digikey.com/en/products/detail/stackpole-electronics-inc/RMCF0402FT51R0/1714777; Composition: Thick Film; Device Package: 0402 (1005 Metric); Features: Automotive AEC-Q200; Height - Seated (Max): 0.016" (0.40mm); LastUpdated: 2023-06-12 7:32:12 PM; Lifecycle Status: Active; Minimum Order: 1; Number of Terminations: 2; Operating Temperature: -55°C ~ 155°C; Package / Case: 0402 (1005 Metric); Packaging: CutTape; PartId: 17821; Part Status: Active; Price: 0.01; Ratings: AEC-Q200; Resistance: 51 Ohms; Series: RMCF; Size / Dimension: 0.039" L x 0.020" W (1.00mm x 0.50mm); Supplier 1: DigiKey; Supplier Part Number 1: RMCF0402FT51R0CT-ND; Supplier Device Package: 0402; Tolerance: ±1%
R?#14 R?#15 = RMCF0402FT1M00: RES 1M OHM 1% 1/16W 0402; Manufacturer: Stackpole Electronics Inc; Power (Watts): 0.063W, 1/16W; Temperature Coefficient: ±100ppm/°C; Part Number: RMCF0402FT1M00; Value: 1 MOhms; ComponentLink1Description: Datasheet; ComponentLink1URL: https://www.seielect.com/catalog/sei-rmcf_rmcp.pdf; ComponentLink2Description: DigiKey Link; ComponentLink2URL: https://www.digikey.com/en/products/detail/stackpole-electronics-inc/RMCF0402FT1M00/1761748; Composition: Thick Film; Device Package: 0402 (1005 Metric); Features: Automotive AEC-Q200; Height - Seated (Max): 0.016" (0.40mm); LastUpdated: 2023-06-19 7:32:46 PM; Lifecycle Status: Active; Minimum Order: 1; Number of Terminations: 2; Operating Temperature: -55°C ~ 155°C; Package / Case: 0402 (1005 Metric); Packaging: CutTape; PartId: 4912; Part Status: Active; Price: 0.01; Ratings: AEC-Q200; Resistance: 1 MOhms; Series: RMCF; Size / Dimension: 0.039" L x 0.020" W (1.00mm x 0.50mm); Supplier 1: DigiKey; Supplier Part Number 1: RMCF0402FT1M00CT-ND; Supplier Device Package: 0402; Tolerance: ±1%
R?#16 R?#18 R?#19 = RMCF0402FT10R0: RES 10 OHM 1% 1/16W 0402; Manufacturer: Stackpole Electronics Inc; Power (Watts): 0.063W, 1/16W; Temperature Coefficient: ±100ppm/°C; Part Number: RMCF0402FT10R0; Value: 10 Ohms; ComponentLink1Description: Datasheet; ComponentLink1URL: https://www.seielect.com/catalog/sei-rmcf_rmcp.pdf; ComponentLink2Description: DigiKey Link; ComponentLink2URL: https://www.digikey.com/en/products/detail/stackpole-electronics-inc/RMCF0402FT10R0/1761802; Composition: Thick Film; Device Package: 0402 (1005 Metric); Features: Automotive AEC-Q200; Height - Seated (Max): 0.016" (0.40mm); LastUpdated: 2023-06-19 7:32:46 PM; Lifecycle Status: Active; Minimum Order: 1; Number of Terminations: 2; Operating Temperature: -55°C ~ 155°C; Package / Case: 0402 (1005 Metric); Packaging: CutTape; PartId: 4924; Part Status: Active; Price: 0.01; Ratings: AEC-Q200; Resistance: 10 Ohms; Series: RMCF; Size / Dimension: 0.039" L x 0.020" W (1.00mm x 0.50mm); Supplier 1: DigiKey; Supplier Part Number 1: RMCF0402FT10R0CT-ND; Supplier Device Package: 0402; Tolerance: ±1%
R?#17 = TNPW040251K1BEED: RES 51.1K OHM 0.1% 1/16W 0402; Manufacturer: Vishay Dale; Power (Watts): 0.063W, 1/16W; Temperature Coefficient: ±25ppm/°C; Part Number: TNPW040251K1BEED; Value: 51.1 kOhms; ComponentLink1Description: Datasheet; ComponentLink1URL: http://www.vishay.com/docs/28758/tnpw_e3.pdf; ComponentLink2Description: DigiKey Link; ComponentLink2URL: https://www.digikey.com/en/products/detail/vishay-dale/TNPW040251K1BEED/1606505; Composition: Thin Film; Device Package: 0402 (1005 Metric); Features: Anti-Sulfur, Automotive AEC-Q200, Moisture Resistant; Height - Seated (Max): 0.016" (0.40mm); LastUpdated: 2023-06-19 7:31:56 PM; Lifecycle Status: Active; Minimum Order: 1; Number of Terminations: 2; Operating Temperature: -55°C ~ 155°C; Package / Case: 0402 (1005 Metric); Packaging: TapeAndReel; PartId: 20757; Part Status: Active; Price: 0.10; Ratings: AEC-Q200; Resistance: 51.1 kOhms; Series: TNPW e3; Size / Dimension: 0.039" L x 0.020" W (1.00mm x 0.50mm); Supplier 1: DigiKey; Supplier Part Number 1: TNP51.1KDACT-ND; Supplier Device Package: 0402; Tolerance: ±0.1%
U?#1 = UCC21521DWR: Manufacturer: Texas Instruments; Interface IC Type: BUFFER OR INVERTER BASED PERIPHERAL DRIVER; Supplier: Digi-Key; Supplier Part Number: 296-48797-1-ND; Manufacturer Part Number: UCC21521DWR; RoHS: Yes; Category: Gate Drivers; Stock: 5950; Pricing: 1=4.55, 10=4.089, 25=3.8656, 100=3.3502, 250=3.17836, 500=2.85194, 1000=2.40526 (USD); Terminal Finish: Nickel; JESD-609 Code: e4; Moisture Sensitivity Level: 2; Reach SVHC Compliant: Yes; RoHS Compliant: Yes; ComponentLink1URL: https://www.ti.com:443/lit/ds/symlink/ucc21521.pdf?src-supplier=IHS+Markit; ComponentLink1Description: https://www.ti.com:443/lit/ds/symlink/ucc21521.pdf?src-supplier=IHS+Markit; ComponentLink2URL: http://www.ti.com/lit/ds/symlink/ucc21521.pdf?src-supplier=Digi-Key; ComponentLink2Description: http://www.ti.com/lit/ds/symlink/ucc21521.pdf?src-supplier=Digi-Key
U?#2 = AMC1311BQDWVRQ1: Isolation Amplifier, 1 Func, 2121V Isolation-Min, 280MHz Band Width, PDSO8; Manufacturer: Texas Instruments; Supplier: Digi-Key; Supplier Part Number: 296-50924-1-ND; Manufacturer Part Number: AMC1311BQDWVRQ1; RoHS: Yes; Category: Amplifiers - Op Amps, Buffer, Instrumentation; Stock: 2584; Pricing: 1=8.35, 10=7.541, 25=7.1904, 100=6.2435, 250=5.96284, 500=5.43672 (USD); Amplifier Type: ISOLATION AMPLIFIER; Reach SVHC Compliant: Yes; RoHS Compliant: Yes; ComponentLink1URL: https://www.ti.com:443/lit/ds/symlink/amc1302-q1.pdf?src-supplier=IHS+Markit; ComponentLink1Description: https://www.ti.com:443/lit/ds/symlink/amc1302-q1.pdf?src-supplier=IHS+Markit; ComponentLink2URL: http://www.ti.com/general/docs/suppproductinfo.tsp?distId=10&amp;gotoUrl=http%3A%2F%2Fwww.ti.com%2Flit%2Fgpn%2Famc1302-q1&src-supplier=Digi-Key; ComponentLink2Description: http://www.ti.com/general/docs/suppproductinfo.tsp?distId=10&amp;gotoUrl=http%3A%2F%2Fwww.ti.com%2Flit%2Fgpn%2Famc1302-q1&src-supplier=Digi-Key; ComponentLink3URL: http://www.ti.com/lit/gpn/amc1302-q1?src-supplier=Digi-Key; ComponentLink3Description: http://www.ti.com/lit/gpn/amc1302-q1?src-supplier=Digi-Key
U?#3 = AMC1302QDWVRQ1: IC CURRENT ISOLATION 8SOIC